# EAGLE design ComfortMaps (EAGLE 9.6.1)

## Sheet 1 of 2
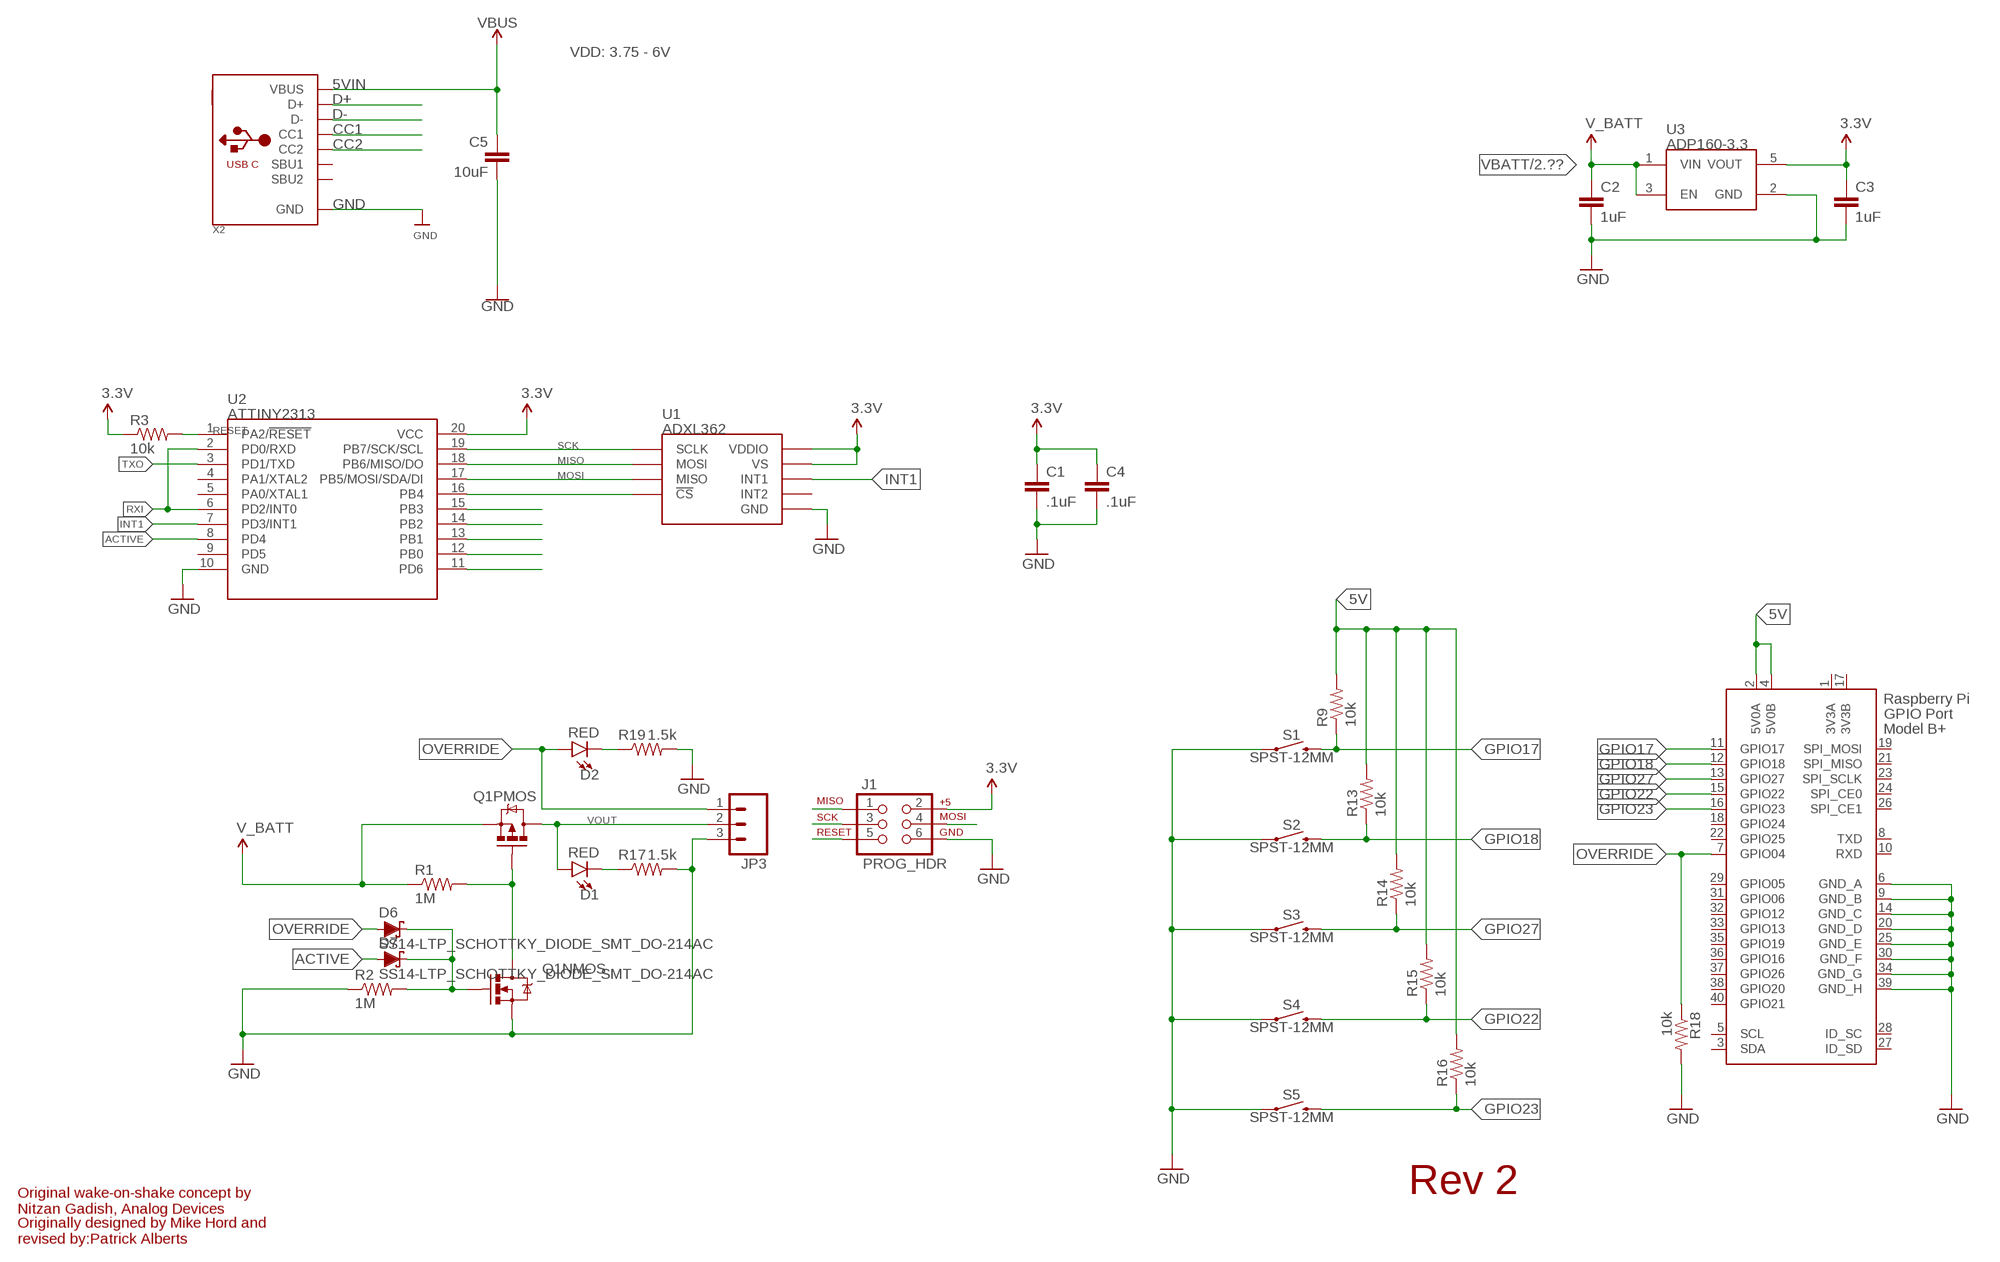
[diagram p0: schematic, sheet 1]

### Parts
C1  .1uF  0.1UF-25V(+80/-20%)(0603)  [0603-CAP]
C2  1uF  1.0UF-16V-10%(0603)  [0603-CAP]
C3  1uF  1.0UF-16V-10%(0603)  [0603-CAP]
C4  .1uF  0.1UF-25V(+80/-20%)(0603)  [0603-CAP]
C5  10uF  10UF-0603-6.3V-20%  [0603]
D1  RED  LED-RED0603  [LED-0603]
D2  RED  LED-RED0603  [LED-0603]
D6  SS14-LTP_SCHOTTKY_DIODE_SMT_DO-214AC  [DO-214AC]
D7  SS14-LTP_SCHOTTKY_DIODE_SMT_DO-214AC  [DO-214AC]
J1  PROG_HDR  AVR_SPI_PRG_6PTH  [2X3]
JP3  M03PTH  [1X03]
Q1  IRF7509  [MSOP8]
R1  1M  1MOHM1/10W1%(0603)  [0603-RES]
R2  1M  1MOHM1/10W1%(0603)  [0603-RES]
R3  10k  10K-1%RES-00824  [0603-RES]
R9  10k  10K-1%RES-00824  [0603-RES]
R13  10k  10K-1%RES-00824  [0603-RES]
R14  10k  10K-1%RES-00824  [0603-RES]
R15  10k  10K-1%RES-00824  [0603-RES]
R16  10k  10K-1%RES-00824  [0603-RES]
R17  1.5k  1.5KOHM-0603-1/10W-1%  [0603]
R18  10k  10K-1%RES-00824  [0603-RES]
R19  1.5k  1.5KOHM-0603-1/10W-1%  [0603]
S1  SPST-12MM  MOMENTARY-SWITCH-SPST-SMD-12MM  [TACTILE_SWITCH_SMD_12MM]
S2  SPST-12MM  MOMENTARY-SWITCH-SPST-SMD-12MM  [TACTILE_SWITCH_SMD_12MM]
S3  SPST-12MM  MOMENTARY-SWITCH-SPST-SMD-12MM  [TACTILE_SWITCH_SMD_12MM]
S4  SPST-12MM  MOMENTARY-SWITCH-SPST-SMD-12MM  [TACTILE_SWITCH_SMD_12MM]
S5  SPST-12MM  MOMENTARY-SWITCH-SPST-SMD-12MM  [TACTILE_SWITCH_SMD_12MM]
U1  ADXL362  ADXL362ADXL362-1:1  [ADXL362-1:1]
U2  ATTINY2313  ATTINY2313A  [SOP20W]
U3  ADP160-3.3  ADP160  [SOT23-5]
X1  RASPI_GPIO_B+#_PIN  [RASPI_GPIO_B+_PIN]
X2  USB_C  [USB_C_CUSB31-CFM2AX-01-X]

### Nets
3.3V: C1.1 C3.1 C4.1 J1.2 R3.1 U1.P$1(VDDIO) U1.P$14(VS) U2.20(VCC) U3.5(VOUT)
5V: R9.2 R13.2 R14.2 R15.2 R16.2 X1.2(5V0A) X1.4(5V0B) ; also sheet 2
5VIN: C5.1 X2.A4B9(VBUS) X2.B4A9(VBUS) ; supply symbol labelled VBUS ; also sheet 2
ACTIVE: D7.A U2.8(PD4)
CC1: X2.A5(CC1)
CC2: X2.B5(CC2)
D+: X2.A6(D+) X2.B6(D+)
D-: X2.A7(D-) X2.B7(D-)
GND: C1.2 C2.2 C3.2 C4.2 C5.2 J1.6 JP3.3 Q1.1(NMOS:S) R2.1 R17.2 R18.2 R19.2 S1.1 S1.2 S2.1 S2.2 S3.1 S3.2 S4.1 S4.2 S5.1 S5.2 U1.P$12(GND) U1.P$13(GND) U1.P$16(GND) U2.10(GND) U3.2(GND) X1.6(GND_A) X1.9(GND_B) X1.14(GND_C) X1.20(GND_D) X1.25(GND_E) X1.30(GND_F) X1.34(GND_G) X1.39(GND_H) X2.A1B12(GND) X2.B1A12(GND) ; also sheet 2
GPIO17: R9.1 S1.3 S1.4 X1.11(GPIO17)
GPIO18: R13.1 S2.3 S2.4 X1.12(GPIO18)
GPIO22: R15.1 S4.3 S4.4 X1.15(GPIO22)
GPIO23: R16.1 S5.3 S5.4 X1.16(GPIO23)
GPIO27: R14.1 S3.3 S3.4 X1.13(GPIO27)
INT1: U1.P$11(INT1) U2.7(PD3/INT1)
MISO: J1.1 U1.P$6(MOSI) U2.18(PB6/MISO/DO)
MOSI: J1.4 U1.P$7(MISO) U2.17(PB5/MOSI/SDA/DI)
N$1: Q1.4(PMOS:G) Q1.7(NMOS:D) Q1.8(NMOS:D) R1.2
N$2: D6.C D7.C Q1.2(NMOS:G) R2.2
N$3: U2.15(PB3)
N$4: U2.14(PB2)
N$5: U2.13(PB1)
N$6: U2.12(PB0)
N$7: U1.P$8(!CS) U2.16(PB4)
N$8: U2.11(PD6)
N$14: D1.C R17.1
N$16: D2.C R19.1
OVERRIDE: D2.A D6.A JP3.1 R18.1 X1.7(GPIO04)
RESET: J1.5 R3.2 U2.1(PA2/!RESET)
RXI: U2.2(PD0/RXD) U2.6(PD2/INT0)
SCK: J1.3 U1.P$4(SCLK) U2.19(PB7/SCK/SCL)
TXO: U2.3(PD1/TXD)
VBATT: C2.1 Q1.3(PMOS:S) R1.1 U3.1(VIN) U3.3(EN) ; supply symbol labelled V_BATT ; also sheet 2
VOUT: D1.A JP3.2 Q1.5(PMOS:D) Q1.6(PMOS:D)
Unconnected: U1.P$9(INT2) U2.4(PA1/XTAL2) U2.5(PA0/XTAL1) U2.9(PD5) X1.3(SDA) X1.5(SCL) X1.8(TXD) X1.10(RXD) X1.18(GPIO24) X1.19(SPI_MOSI) X1.21(SPI_MISO) X1.22(GPIO25) X1.23(SPI_SCLK) X1.24(SPI_CE0) X1.26(SPI_CE1) X1.27(ID_SD) X1.28(ID_SC) X1.29(GPIO05) X1.31(GPIO06) X1.32(GPIO12) X1.33(GPIO13) X1.35(GPIO19) X1.36(GPIO16) X1.37(GPIO26) X1.38(GPIO20) X1.40(GPIO21) X2.A8(SBU1) X2.B8(SBU2)

### Notes on the sheet
- VDD: 3.75 - 6V
- Rev 2
- Original wake-on-shake concept by
  Nitzan Gadish, Analog Devices
- Originally designed by Mike Hord and 
  revised by:Patrick Alberts

## Sheet 2 of 2
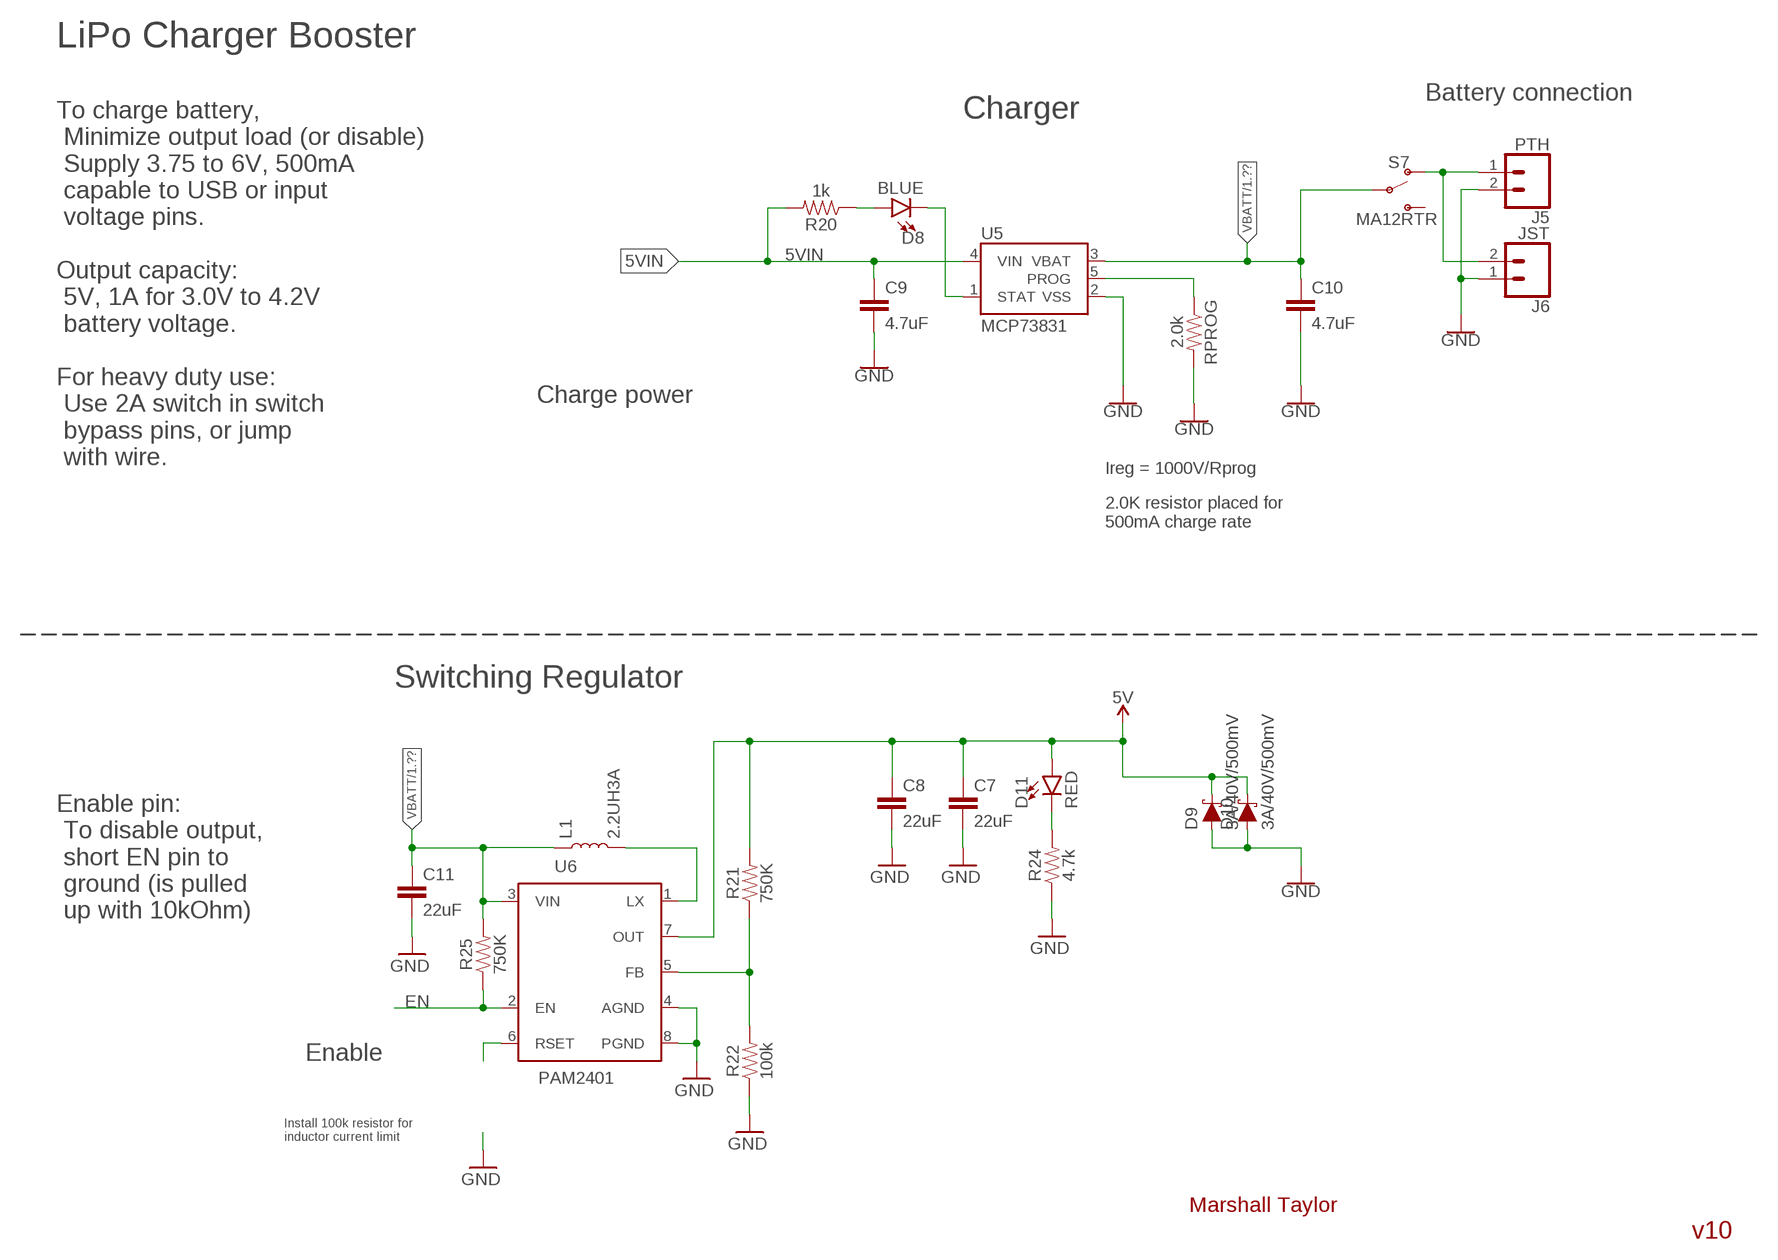
[diagram p1: schematic, sheet 2]

### Parts
C7  22uF  22UF-0805-6.3V-20%  [0805]
C8  22uF  22UF-0805-6.3V-20%  [0805]
C9  4.7uF  4.7UF0603  [0603]
C10  4.7uF  4.7UF0603  [0603]
C11  22uF  22UF-0805-6.3V-20%  [0805]
D8  BLUE  LED-BLUE0603  [LED-0603]
D9  3A/40V/500mV  DIODE-SCHOTTKY-B340A  [SMA-DIODE]
D10  3A/40V/500mV  DIODE-SCHOTTKY-B340A  [SMA-DIODE]
D11  RED  LED-RED0603  [LED-0603]
J5  PTH  CONN_02  [1X02]
J6  JST  CONN_02-JST-2MM-SMT  [JST-2-SMD]
L1  2.2UH3A  INDUCTOR-IFSC1515AHER2R2M01  [INDUCTOR_4X4MM]
R20  1k  1KOHM-0603-1/10W-1%  [0603]
R21  750K  750KOHM-0603-1/10W-1%  [0603]
R22  100k  100KOHM-0603-1/10W-1%  [0603]
R24  4.7k  4.7KOHM-0603-1/10W-1%  [0603]
R25  750K  750KOHM-0603-1/10W-1%  [0603]
RPROG  2.0k  2.0KOHM-0603-1/10W-5%  [0603]
S7  MA12RTR  SWITCH-SPDT-SMD-RIGHT-ANGLE  [SWITCH_SPST_SMD_A]
U5  MCP73831  [SOT23-5]
U6  PAM2401  [MSOP8]

### Nets
5V: C7.1 C8.1 D9.C D10.C D11.A R21.2 U6.7(OUT) ; also sheet 1
5VIN: C9.1 R20.2 U5.4(VIN) ; also sheet 1
EN: R25.1 U6.2(EN)
GND: C7.2 C8.2 C9.2 C10.2 C11.2 D9.A D10.A J5.2 J6.1 R22.1 R24.1 RPROG.2 U5.2(VSS) U6.4(AGND) U6.8(PGND) ; also sheet 1
N$9: J5.1 J6.2 S7.1(O)
N$10: RPROG.1 U5.5(PROG)
N$13: D8.C U5.1(STAT)
N$17: R21.1 R22.2 U6.5(FB)
N$18: L1.P$2 U6.1(LX)
N$19: U6.6(RSET)
N$21: D11.C R24.2
N$22: D8.A R20.1
VBATT: C10.1 C11.1 L1.P$1 R25.2 S7.2(P) U5.3(VBAT) U6.3(VIN) ; also sheet 1
Unconnected: S7.3(S)

### Notes on the sheet
- LiPo Charger Booster
- To charge battery,
   Minimize output load (or disable)
   Supply 3.75 to 6V, 500mA
   capable to USB or input
   voltage pins.
- Battery connection
- Charger
- Output capacity:
   5V, 1A for 3.0V to 4.2V
   battery voltage.
- For heavy duty use:
   Use 2A switch in switch
   bypass pins, or jump
   with wire.
- Charge power
- Ireg = 1000V/Rprog
- 2.0K resistor placed for
  500mA charge rate
- Switching Regulator
- Enable pin:
   To disable output,
   short EN pin to
   ground (is pulled
   up with 10kOhm)
- Enable
- Install 100k resistor for
  inductor current limit
- Marshall Taylor
- v10

## Power pins joined to a net without a drawn wire
3V3A: X1.1(3V3A)
3V3B: X1.17(3V3B)

## Library data of the parts
C1 C4 = SparkFun-Capacitors:0.1UF-25V(+80/-20%)(0603): CAP-00810 Ceramic Standard decoupling cap; PROD_ID: CAP-00810; VALUE: 0.1uF
C2 C3 = SparkFun-Capacitors:1.0UF-16V-10%(0603): CAP-00868; PROD_ID: CAP-00868; VALUE: 1.0uF
C5 = SparkFun-Capacitors:10UF: 10.0µF ceramic capacitors A capacitor is a passive two-terminal electrical component used to store electrical energy temporarily in an electric field.; PROD_ID: CAP-11015
C7 C8 C11 = SparkFun-Capacitors:22UF: 22µF ceramic capacitors A capacitor is a passive two-terminal electrical component used to store electrical energy temporarily in an electric field.; PROD_ID: CAP-08402
C9 C10 = SparkFun-Capacitors:4.7UF: 4.7µF ceramic capacitors A capacitor is a passive two-terminal electrical component used to store electrical energy temporarily in an electric field.; PROD_ID: CAP-08280
D1 D2 D11 = SparkFun-LED:LED-RED: Red SMD LED Used in manufacturing of most products at SparkFun Packages: 0603 - SMD 0603 package [Product Link] <http://docs.avagotech.com/docs/AV02-0551EN> 0603 SMART - SMD 0603 SMART package ( more efficient and expensive)[Product Link] <http://www.osram-os.com/Graphics/XPic2/00077099_0.pdf> 1206 - SMD1206 package [Product Link] <https://www.sparkfun.com/datasheets/DevTools/LilyPad/Q150OVS4.pdff> SparkFun Products: Pro Mini 328 -5V <https://www.sparkfun.com/products/821> RedBoard <https://www.sparkfun.com/products/12757> IOIO-OTG <https://www.sparkfun.com/products/13613>; PROD_ID: DIO-00819
D6 D7 = DIODE SCHOTTKY 1A 40V SMA:SS14-LTP_SCHOTTKY_DIODE_SMT_DO-214AC: DIODE SCHOTTKY 1A 40V SMA; DIGIKEY: SS14-LTPMSCT-ND; MF: Micro Commercial Co; MPN: SS14-LTP
D8 = SparkFun-LED:LED-BLUE: Blue SMD LED Used in manufacturing of various products at SparkFun Packages: 0603 - SMD 0603 package [Product Link] <http://www.digikey.com/product-detail/en/SMLE12BC7TT86/511-1589-2-ND/1641808> 1206 - SMD1206 package [Product Link] <http://www.digikey.com/product-detail/en/lite-on-inc/LTST-C150TBKT/160-1643-1-ND/573584> SparkFun Products: ESP8266 Thing-Dev Board <https://www.sparkfun.com/products/13711> RedBoard <https://www.sparkfun.com/products/12757>; PROD_ID: DIO-08575
D9 D10 = SparkFun-DiscreteSemi:DIODE-SCHOTTKY: Schottky diode A Schottky diode is a semiconductor diode which has a low forward voltage drop and a very fast switching action.; PROD_ID: DIO-09886
J1 = SparkFun-Connectors:AVR_SPI_PRG_6: AVR ISP 6 Pin This is the reduced ISP connector for AVR programming. Common on Arduino. This footprint will take up less PCB space and can be used with a 10-pin to 6-pin adapter such as SKU: BOB-08508
J5 = SparkFun-Connectors:CONN_02: Multi connection point. Often used as Generic Header-pin footprint for 0.1 inch spaced/style header connections On any of the 0.1 inch spaced packages, you can populate with these: Break Away Headers - Straight <https://www.sparkfun.com/products/116> (PRT-00116) Break Away Male Headers - Right Angle <https://www.sparkfun.com/products/553> (PRT-00553) Female Headers <https://www.sparkfun.com/products/115> (PRT-00115) Break Away Headers - Machine Pin <https://www.sparkfun.com/products/117> (PRT-00117) Break Away Female Headers - Swiss Machine Pin <https://www.sparkfun.com/products/743> (PRT-00743) For SCREWTERMINALS and SPRING TERMINALS visit here: Screw Terimnals on SparkFun.com <https://www.sparkfun.com/search/results?term=Screw+Terminals> (5mm/3.5mm/2.54mm spacing) This device is also useful as a general connection point to wire up your design to another part of your project. Our various solder wires solder well into these plated through hole pads. Hook-Up Wire - Assortment (Stranded, 22 AWG) <https://www.sparkfun.com/products/11375> (PRT-11375) Hook-Up Wire - Assortment (Solid Core, 22 AWG) <https://www.sparkfun.com/products/11367> (PRT-11367) View the entire wire category on our website here <https://www.sparkfun.com/categories/141> Special notes: Molex polarized connector foot print use with: PRT-08233 with associated crimp pins and housings. 2.54_SCREWTERM for use with PRT-10571. 3.5mm Screw Terminal footprints for PRT-08084 5mm Screw Terminal footprints for use with PRT-08432
J6 = SparkFun-Connectors:CONN_02: Multi connection point. Often used as Generic Header-pin footprint for 0.1 inch spaced/style header connections On any of the 0.1 inch spaced packages, you can populate with these: Break Away Headers - Straight <https://www.sparkfun.com/products/116> (PRT-00116) Break Away Male Headers - Right Angle <https://www.sparkfun.com/products/553> (PRT-00553) Female Headers <https://www.sparkfun.com/products/115> (PRT-00115) Break Away Headers - Machine Pin <https://www.sparkfun.com/products/117> (PRT-00117) Break Away Female Headers - Swiss Machine Pin <https://www.sparkfun.com/products/743> (PRT-00743) For SCREWTERMINALS and SPRING TERMINALS visit here: Screw Terimnals on SparkFun.com <https://www.sparkfun.com/search/results?term=Screw+Terminals> (5mm/3.5mm/2.54mm spacing) This device is also useful as a general connection point to wire up your design to another part of your project. Our various solder wires solder well into these plated through hole pads. Hook-Up Wire - Assortment (Stranded, 22 AWG) <https://www.sparkfun.com/products/11375> (PRT-11375) Hook-Up Wire - Assortment (Solid Core, 22 AWG) <https://www.sparkfun.com/products/11367> (PRT-11367) View the entire wire category on our website here <https://www.sparkfun.com/categories/141> Special notes: Molex polarized connector foot print use with: PRT-08233 with associated crimp pins and housings. 2.54_SCREWTERM for use with PRT-10571. 3.5mm Screw Terminal footprints for PRT-08084 5mm Screw Terminal footprints for use with PRT-08432; PROD_ID: CONN-11443
JP3 = SparkFun-Connectors:M03: Header 3 Standard 3-pin 0.1" header. Use with straight break away headers (SKU : PRT-00116), right angle break away headers (PRT-00553), swiss pins (PRT-00743), machine pins (PRT-00117), and female headers (PRT-00115). Molex polarized connector foot print use with SKU : PRT-08232 with associated crimp pins and housings.
L1 = SparkFun-Coils:INDUCTOR: Inductors Resist changes in electrical current. Basically a coil of wire. SparkFun Products: SparkFun Load Cell Amplifier - HX711 <https://www.sparkfun.com/products/13879> IOIO-OTG - V2.2 <https://www.sparkfun.com/products/13613>; PROD_ID: NDUC-13770
Q1 = SparkFun-DiscreteSemi:IRF7509: 30V Dual PMOS/NMOS MSOP-8 NMOS RDS .11-ohm PMOS RDS .20-ohm; PROD_ID: TRANS-07913
R1 R2 = SparkFun-Resistors:1MOHM1/10W1%(0603): RES-07868; PROD_ID: RES-07868
R3 R9 R13-R16 R18 = SparkFun-Resistors:10K-1%: 10k-ohm SMT 1/10W - 1% (0603) RES-00824; PROD_ID: RES-00824
R17 R19 = SparkFun-Resistors:1.5KOHM: 1.5kΩ resistor A resistor is a passive two-terminal electrical component that implements electrical resistance as a circuit element. Resistors act to reduce current flow, and, at the same time, act to lower voltage levels within circuits. - Wikipedia; PROD_ID: RES-08306
R20 = SparkFun-Resistors:1KOHM: 1kΩ resistor A resistor is a passive two-terminal electrical component that implements electrical resistance as a circuit element. Resistors act to reduce current flow, and, at the same time, act to lower voltage levels within circuits. - Wikipedia; PROD_ID: RES-07856
R21 R25 = SparkFun-Resistors:750KOHM: 750Ω resistor A resistor is a passive two-terminal electrical component that implements electrical resistance as a circuit element. Resistors act to reduce current flow, and, at the same time, act to lower voltage levels within circuits. - Wikipedia; PROD_ID: RES-13768
R22 = SparkFun-Resistors:100KOHM: 100kΩ resistor A resistor is a passive two-terminal electrical component that implements electrical resistance as a circuit element. Resistors act to reduce current flow, and, at the same time, act to lower voltage levels within circuits. - Wikipedia; PROD_ID: RES-07828
R24 = SparkFun-Resistors:4.7KOHM: 4.7kΩ resistor A resistor is a passive two-terminal electrical component that implements electrical resistance as a circuit element. Resistors act to reduce current flow, and, at the same time, act to lower voltage levels within circuits. - Wikipedia; PROD_ID: RES-07857
RPROG = SparkFun-Resistors:2.0KOHM: 2kΩ resistor A resistor is a passive two-terminal electrical component that implements electrical resistance as a circuit element. Resistors act to reduce current flow, and, at the same time, act to lower voltage levels within circuits. - Wikipedia; PROD_ID: RES-08296
S1-S5 = CM-SparkFun-Switches:MOMENTARY-SWITCH-SPST: Momentary Switch (Pushbutton) - SPST Normally-open (NO) SPST momentary switches (buttons, pushbuttons). Variants PTH-12MM - 12mm square, through-hole Momentary Pushbutton Switch - 12mm Square <https://www.sparkfun.com/products/9190> (COM-09190) PTH-6.0MM, PTH-6.0MM-KIT - 6.0mm square, through-hole Mini Pushbutton Switch <https://www.sparkfun.com/products/97> (COM-00097) KIT package intended for soldering kit's - only one side of pads' copper is exposed. PTH-RIGHT-ANGLE-KIT - Right-angle, through-hole Right Angle Tactile Button <https://www.sparkfun.com/products/10791> - Used on SparkFun BigTime Watch Kit <https://www.sparkfun.com/products/11734> SMD-12MM - 12mm square, surface-mount Tactile Button - SMD (12mm) <https://www.sparkfun.com/products/12993> (COM-12993) Used on SparkFun PicoBoard <https://www.sparkfun.com/products/11888> SMD-4.5MM - 4.5mm Square Trackball Switch Used on SparkFun Blackberry Trackballer Breakout <https://www.sparkfun.com/products/13169> SMD-4.6MMX2.8MM - 4.60mm x 2.80mm, surface mount Used on SparkFun SAMD21 Mini Breakout <https://www.sparkfun.com/products/13664> SMD-5.2MM, SMD-5.2-REDUNDANT - 5.2mm square, surface-mount Mini Pushbutton Switch - SMD <https://www.sparkfun.com/products/8720> (COM-08720) Used on Arduino Pro Mini <https://www.sparkfun.com/products/11114> REDUNDANT package connects both switch circuits together SMD-6.0X3.5MM - 6.0 x 3.5mm, surface mount Momentary Reset Switch SMD <https://www.sparkfun.com/products/8229> (COM-08229) SMD-6.2MM-TALL - 6.2mm square, surface mount Tactile Button - SMD (6mm) <https://www.sparkfun.com/products/12992> Used on SparkFun Digital Sandbox <https://www.sparkfun.com/products/12651> SMD-RIGHT-ANGLE - Right-angle, surface mount Used on SparkFun Block for Intel® Edison - Arduino <https://www.sparkfun.com/products/13036>; PROD_ID: SWCH-11967; SF_SKU: COM-12993
S7 = SparkFun-Switches:SWITCH-SPDT: Single Pole, Double Throw (SPDT) Switch Single-pole, double-throw (SPDT) switch. Variant Overview SMD-AYZ0202 Surface Mount DPDT Switch <https://www.sparkfun.com/products/597> (COM-00597) Used on e.g. LilyPad Arduino USB - ATmega32U4 Board <https://www.sparkfun.com/products/12049> PTH-11.6X4.0MM SPDT Mini Power Switch <https://www.sparkfun.com/products/102> (COM-00102) Used on e.g. SparkFun Simon Says - Through-Hole Soldering Kit <https://www.sparkfun.com/products/10547> (KIT-10547) PTH-11.6X4.0MM-KIT KIT version of SPDT Mini Power Switch - Simplifies soldering by removing tStop of switch pins - only one side can be soldered. PTH-11.6X4.0MM-LOCK LOCK version of SPDT Mini Power Switch - Offset pins hold switch in place for easier soldering. SMD-RIGHT-ANGLE Surface Mount Right Angle Switch <https://www.sparkfun.com/products/10860> (COM-10860) Used on e.g. SparkFun ESP8266 Thing <https://www.sparkfun.com/products/13231>; DIGIKEY: 679-1847-1-ND; PROD_ID: SWCH-10651; SF_SKU: COM-10860
U1 = SparkFun-Sensors:ADXL362: Micropower 3-axis accelerometer 2/4/8g digital output (SPI) IC-11297
U2 = SparkFun-DigitalIC:ATTINY2313A: ATTINY2313A 2kB 20MHz I2C/SPI/UART; DIST: DIGIKEY; DIST_ID: ATTINY2313A-SU-ND; PROD_ID: IC-11305; VALUE: ATTINY2313A
U3 = SparkFun-PowerIC:ADP160: Nanopower LDO Iq less than 1uA for low Iload; DIST: Digikey; DIST_ID: ADP160AUJZ-3.3-R7TR-ND; PROD_ID: VREG-11306; VALUE: ADP160
U5 = SparkFun-IC-Power:MCP73831: MCP73831T Li-Ion, Li-Pol Controller Miniature single cell, fully integrated Li-Ion, Li-polymer charge management controller Datasheet <http://ww1.microchip.com/downloads/en/DeviceDoc/20001984g.pdf> SparkFun Products: SparkFun ESP32 Thing <https://www.sparkfun.com/products/13907> SparkFun 9DoF Razor IMU M0 <https://www.sparkfun.com/products/14001>; PROD_ID: IC-09995
U6 = SparkFun-IC-Power:PAM2401: PAM2401 - Boost PMIC Specifications: Up to 1A output current 0.9V to 4.75V Input Range 2.5V to 5.0V Adjustable Output Voltage Datasheet <https://www.diodes.com/assets/Datasheets/PAM2401.pdf> (Diodes inc.); PROD_ID: IC-13769
X1 = raspberrypi_bastelstube_v13:RASPI_GPIO_B+#: 2x20 header connector, all pins connected
X2 = microbuilder:USB_C: USB Type-C USB 2.0 Connector

## Net classes
0 default: width 0.152 mm, drill 0.305 mm, clearance 0.152 mm

## Board
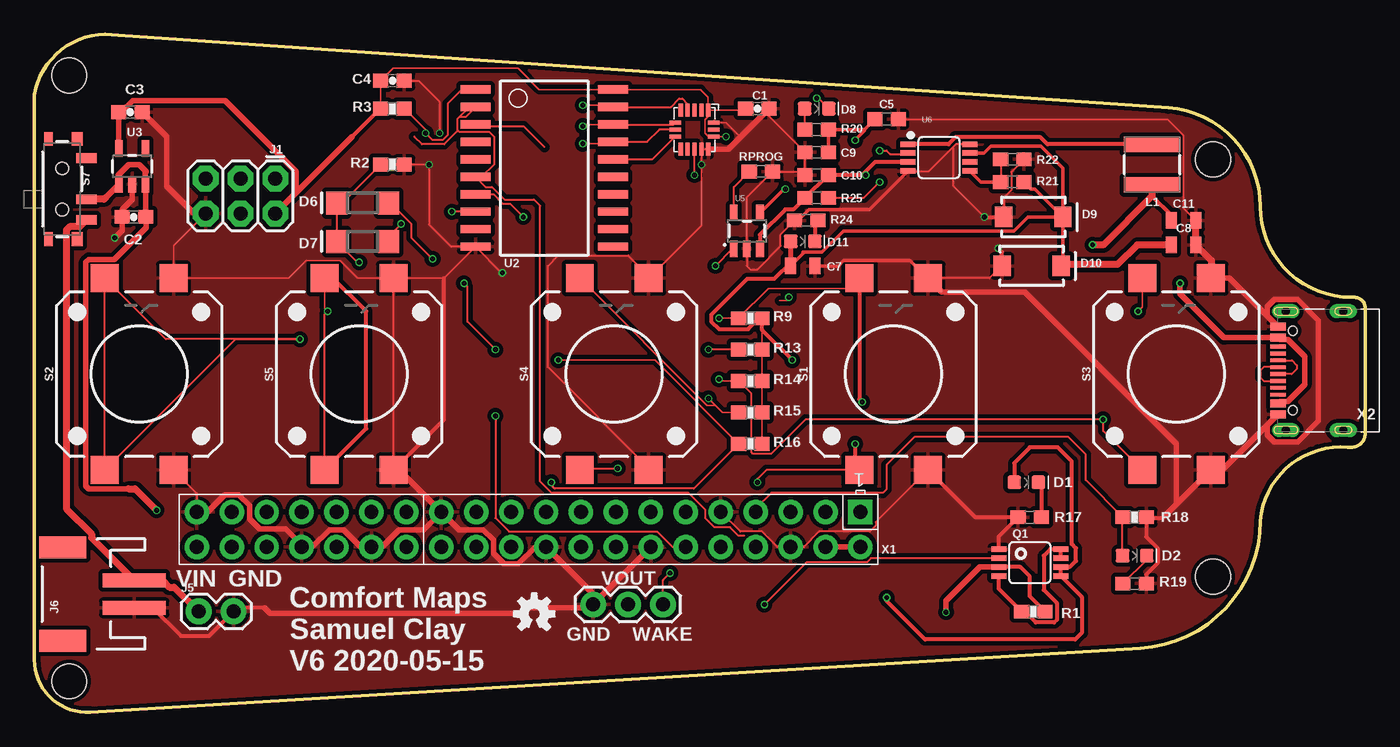
[diagram p2: board, top side]
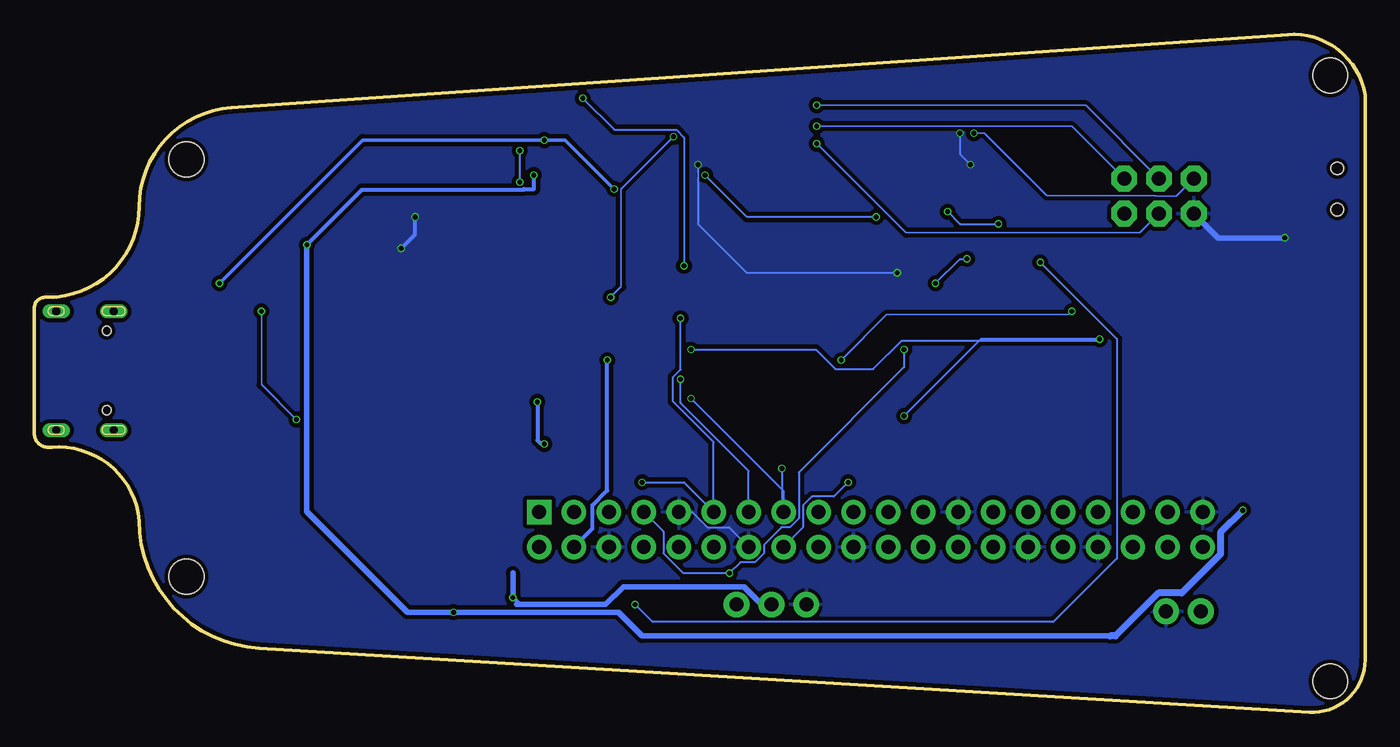
[diagram p3: board, bottom side, seen from below]

Size 96.77 x 49.31 mm. Coordinates in mm from the lower left corner, seen from the top.
Outline: 96.77,20.28 96.77,29.42 arc90 96.01,30.19 95.76,30.19 arc-90 89.15,36.79 arc86 82.45,43.97 6.11,49.24 arc90 0,44.9 0,3.82 arc93 4.06,0 80.44,4.65 arc86 89.15,13.93 arc-90 95.5,19.26 95.76,19.26 arc90 96.77,20.28
Copper layers (1*16): Top 0.035mm / dielectric 0.213359375mm / Bottom 0.035mm
Design rules "SparkFun-4-layer-PCBWAY-LIMIT *": minimum track width 5mil, minimum drill 0.3mm, track to track 6mil, track to pad 6mil, pad to pad 5mil, via to via 6mil, smd to smd 0mil, copper to edge 5mil, drill to drill 5mil, minimum pad ring 3mil, minimum via ring 3mil, stop-mask expansion 4mil, vias tented up to drill 25mil, thermal gap 10mil
Holes 2.54 mm at 2.54,46.31 2.54,2.25 85.72,9.87 85.72,40.22

### Footprints (pad centres in the part's own frame; a part is rotated, then mirrored left to right if it is on the bottom)
0603-CAP = smd 1.1 x 1: 1 -0.85,0; 2 0.85,0
0603 = smd 1.1 x 1: 1 -0.85,0; 2 0.85,0
0805 = smd 0.8 x 1.2: 1 -0.9,0; 2 0.9,0
LED-0603 = smd 1 x 1: A -0.877,0; C 0.877,0
DO-214AC = smd 1.524 x 1.676: A 1.88,0; C -1.88,0
SMA-DIODE = smd 1.27 x 1.47: A -2.15,0; C 2.15,0
2X3 = drill 1.016 pad 1.88 octagon: 1 0,0; 2 0,2.54; 3 2.54,0; 4 2.54,2.54; 5 5.08,0; 6 5.08,2.54
1X02 = drill 1.016 pad 1.88: 1 0,0; 2 2.54,0
JST-2-SMD = smd 1 x 4.6: 1 -1,-3.7; 2 1,-3.7 | smd 1.6 x 3.4: NC1 -3.4,1.5; NC2 3.4,1.5
1X03 = drill 1.016 pad 1.88: 1 0,0; 2 2.54,0; 3 5.08,0
INDUCTOR_4X4MM = smd 4.089 x 1.143: P$1 0,1.473; P$2 0,-1.473
MSOP8 = smd 0.4 x 1.1: 1 -0.975,-2.25; 2 -0.325,-2.25; 3 0.325,-2.25; 4 0.975,-2.25; 5 0.975,2.25; 6 0.325,2.25; 7 -0.325,2.25; 8 -0.975,2.25
0603-RES = smd 1.1 x 1: 1 -0.85,0; 2 0.85,0
TACTILE_SWITCH_SMD_12MM = smd 2.032 x 2.032: 1 6.975,-2.5; 2 -6.975,-2.5; 3 6.975,2.5; 4 -6.975,2.5
SWITCH_SPST_SMD_A = smd 0.7 x 1.5: 1 -2.25,-1.75; 2 -0.75,-1.75; 3 2.25,-1.75 | smd 1 x 0.6: GND1 -3.65,1; GND3 3.65,1 | smd 1 x 0.8: GND2 -3.65,-1.1; GND4 3.65,-1.1 | hole 0.9: -1.5,0; 1.5,0
ADXL362-1:1 = smd 0.952 x 0.3: P$1 -1.426,1; P$2 -1.426,0.5; P$3 -1.426,0; P$4 -1.426,-0.5; P$5 -1.426,-1; P$9 1.426,-1; P$10 1.426,-0.5; P$11 1.426,0; P$12 1.426,0.5; P$13 1.426,1 | smd 0.3 x 0.851: P$6 -0.5,-1.402; P$7 0,-1.402; P$8 0.5,-1.402; P$14 0.5,1.402; P$15 0,1.402; P$16 -0.5,1.402
SOP20W = smd 0.6 x 2.2: 1 -5.715,-5; 2 -4.445,-5; 3 -3.175,-5; 4 -1.905,-5; 5 -0.635,-5; 6 0.635,-5; 7 1.905,-5; 8 3.175,-5; 9 4.445,-5; 10 5.715,-5; 11 5.715,5; 12 4.445,5; 13 3.175,5; 14 1.905,5; 15 0.635,5; 16 -0.635,5; 17 -1.905,5; 18 -3.175,5; 19 -4.445,5; 20 -5.715,5
SOT23-5 = smd 0.55 x 1.2: 1 -0.95,-1.3; 2 0,-1.3; 3 0.95,-1.3; 4 0.95,1.3; 5 -0.95,1.3
RASPI_GPIO_B+_PIN = drill 1 pad 1.778 square: 1 -24.13,-1.27 | drill 1 pad 1.778: 2 -24.13,1.27; 3 -21.59,-1.27; 4 -21.59,1.27; 5 -19.05,-1.27; 6 -19.05,1.27; 7 -16.51,-1.27; 8 -16.51,1.27; 9 -13.97,-1.27; 10 -13.97,1.27; 11 -11.43,-1.27; 12 -11.43,1.27; 13 -8.89,-1.27; 14 -8.89,1.27; 15 -6.35,-1.27; 16 -6.35,1.27; 17 -3.81,-1.27; 18 -3.81,1.27; 19 -1.27,-1.27; 20 -1.27,1.27; 21 1.27,-1.27; 22 1.27,1.27; 23 3.81,-1.27; 24 3.81,1.27; 25 6.35,-1.27; 26 6.35,1.27; 27 8.89,-1.27; 28 8.89,1.27; 29 11.43,-1.27; 30 11.43,1.27; 31 13.97,-1.27; 32 13.97,1.27; 33 16.51,-1.27; 34 16.51,1.27; 35 19.05,-1.27; 36 19.05,1.27; 37 21.59,-1.27; 38 21.59,1.27; 39 24.13,-1.27; 40 24.13,1.27
USB_C_CUSB31-CFM2AX-01-X = smd 0.575 x 1.15: A1B12 -3.2,7.355; A4B9 -2.4,7.355; B1A12 3.2,7.355; B4A9 2.4,7.355 | smd 0.275 x 1.15: A5 -1.25,7.355; A6 -0.25,7.355; A7 0.25,7.355; A8 1.25,7.355; B5 1.75,7.355; B6 0.75,7.355; B7 -0.75,7.355; B8 -1.75,7.355 | drill 0.6 pad 1 long: M1 -4.32,6.78; M2 4.32,6.78; M3 -4.32,2.6; M4 4.32,2.6 | hole 0.65: 2.89,6.28; -2.89,6.28

### Placement (x,y rotation side)
C1  52.58,43.9 0 top
C2  7.24,36.03 180 top
C3  6.98,43.65 0 top
C4  26.04,45.93 0 top
C5  61.98,43.14 0 top
C7  55.88,32.47 0 top
C8  83.57,34 0 top
C9  56.9,40.73 180 top
C10  56.9,39.08 180 top
C11  83.57,35.77 0 top
D1  72.14,16.72 0 top
D2  80.01,11.39 0 top
D6  23.88,37.04 0 top
D7  23.88,34.25 0 top
D8  56.9,43.9 0 top
D9  72.64,36.03 0 top
D10  72.52,32.47 0 top
D11  55.88,34.25 0 top
J1  17.53,38.82 180 top
J5  11.94,7.33 0 top
J6  3.56,8.6 90 top
JP3  45.72,7.83 180 top
L1  81.28,39.84 180 top
Q1  72.39,10.88 270 top
R1  72.64,7.33 180 top
R2  26.04,39.84 180 top
R3  26.04,43.9 0 top
R9  52.07,28.66 0 top
R13  52.07,26.38 0 top
R14  52.07,24.09 0 top
R15  52.07,21.8 0 top
R16  52.07,19.52 0 top
R17  72.39,14.18 180 top
R18  80.01,14.18 0 top
R19  80.01,9.36 0 top
R20  56.9,42.38 0 top
R21  71.12,38.57 0 top
R22  71.12,40.22 180 top
R24  56.13,35.77 0 top
R25  56.9,37.42 180 top
RPROG  52.83,39.33 0 top
S1  62.48,24.6 90 top
S2  7.62,24.6 90 top
S3  83.06,24.6 90 top
S4  42.16,24.6 90 top
S5  23.62,24.6 90 top
S7  2.03,38.06 90 top
U1  48.01,42.38 270 top
U2  37.08,39.58 270 top
U3  7.11,39.71 0 top
U5  51.82,35.01 0 top
U6  65.79,40.35 270 top
U$3  [OSHW-LOGO-S]  36.35,7.15 0 top
X1  35.94,13.29 180 top
X2  97.79,24.85 90 top

### Tracks (layer width: path | path; a pad name or v marks a point on that pad's centre or on a via)
3.3V  (via drill 0.35)
  Top 0.127: U1.P$1 49.01,43.36 48.77,43.12 48.77,42.14 49.15,41.76 49.29,41.76 U1.P$14 v50.29,41.87 | U1.P$1 51.63,43.8 C1.1 | U1.P$1 49,43.81 49,44.75 48.45,45.3 U2.20 36.7,45.3 35.17,46.83 26.08,46.83 C4.1 R3.1 | 54.19,29.93 54.86,29.93 v54.86,30.19
  Top 0.152: 6.13,41.11 6.13,41.04 U3.5
  Top 0.305: 23.11,41.87 25.15,43.9 R3.1
  Top 0.406: 6.13,41.11 C3.1 6.28,43.65 7.14,44.5 13.88,44.5 19.05,39.33 19.05,37.81 J1.2 23.11,41.87
  Bottom 0.127: v54.86,30.19 54.1,30.95 54.1,38.06 v50.29,41.87
5V  (via drill 0.35)
  Top 0.127: R9.2 R13.2 R14.2 R15.2 R16.2
  Top 0.254: U6.7 69.05,40.67 69.56,41.18 73.2,41.18 74.79,39.58 D9.C | D9.C 72.76,38.06 72.48,38.06 R21.2 | D9.C 74.79,32.6 D10.C | C7.1 55.88,33.37 55.88,33.49 56.21,33.49 56.23,33.47 57.28,33.47 58.83,35.01 71.25,35.01 72.26,36.03 D9.C
  Top 0.305: C7.1 54.98,34.23 D11.A 55,32.73 53.79,31.51 51.84,31.51 49.22,28.9 49.22,28.43 49.79,27.86 51.9,27.86 52.7,28.66 R9.2 52.92,27.81 v55.12,25.61
  Top 0.406: X1.2 X1.4
  Top 0.508: D10.C 74.76,32.56 78.76,32.56 80.19,34 C8.1
  Bottom 0.305: X1.4 56.18,13.37 56.18,15.06 55.12,16.13 v55.12,25.61
5VIN  (via drill 0.35)
  Top 0.254: C5.1 60.36,42.38 | 60.36,42.38 R20.2 C9.1 | U5.4 54.51,38.06 v54.61,38.06 | v59.69,41.62 60.36,42.29 60.36,42.38
  Top 0.406: v83.31,31.2 83.31,30.44 86.5,27.25 X2.B4A9 90.59,27.09 91.16,27.09 92.38,25.87 92.38,23.83 91.16,22.61 90.59,22.61 X2.A4B9
  Bottom 0.254: v54.61,38.06 58.17,41.62 v59.69,41.62 72.9,41.62 v83.31,31.2
ACTIVE  (via drill 0.35)
  Top 0.152: U2.8 v30.35,36.41 | v26.67,35.52 25.76,34.61 D7.A
  Bottom 0.152: v30.35,36.41 29.46,35.52 v26.67,35.52
D+
  Top 0.152: X2.B6 91.43,25.6 91.44,25.61 91.82,25.23 91.82,24.98 91.44,24.6 X2.A6
D-
  Top 0.152: X2.A7 89.4,25.1 89.15,24.85 89.15,24.34 89.4,24.1 X2.B7
EN  (via drill 0.35)
  Top 0.152: R25.1 60.33,37.42 v61.47,38.57 | v61.47,40.85 61.98,40.85 62.23,40.6 63.47,40.6 U6.2
  Bottom 0.152: v61.47,38.57 v61.47,40.85
GND  (via drill 0.35)
  Top 0.127: U1.P$16 50.29,42.89 51.19,41.99 51.19,41.75 50.39,40.95 U1.P$13 U1.P$12 v48.51,39.84 48.51,35.41 44.75,31.66 S4.1 | S3.1 85.6,31.57 | U2.10 29.79,31.57 26.16,31.57 S5.1 23.51,31.57 22.24,32.84 19.75,32.84 18.48,31.57 S2.1 10.12,33.96 J1.6
  Top 0.152: v34.04,31.96 33.99,31.96 U2.10 30.31,33.87 28.7,35.47 v28.7,39.84 R2.1 | C4.2 27.94,45.93 29.46,44.41 v29.46,42.12 | X1.9 51.33,13.14 52.91,13.14 54.03,12.02 X1.6 55.95,12.02 57.07,13.14 60.75,13.14 61.19,13.58 61.19,13.83 S1.2 | S2.2 11.81,15.93 X1.39 | S5.2 26.12,31.53 26.16,31.57 | S4.2 44.66,17.78 37.34,25.11 37.34,32.47 38.1,33.23 43.18,33.23 44.75,31.66 | 82.21,14.27 82.12,14.18 | 85.26,17.32 S3.2 | R22.1 71.05,39.3 71.05,37.97 70.49,37.42 D9.A | U6.8 67.02,41.32 66.8,41.11 | 66.8,41.11 66.8,38.31 v69.09,36.03 | 70.43,35.96 70.37,35.9 | D10.A 69.47,31.57 S1.1 | C1.2 53.43,43.34 C9.2 C10.2 55.79,39.33 RPROG.2 51.82,37.46 U5.2 51.82,32.47 52.07,32.22 52.58,32.22 54.27,33.91 54.27,34.76 R24.1 | U6.4 65.06,39.37 66.8,41.11 | C11.2 83.55,36.69 83.55,41.98 82.39,43.14 C5.2
  Top 0.254: C7.2 58.46,32.47 58.85,32.87 63.69,32.87 S1.1 | R24.1 55.54,35.77 56.32,36.55 60.72,36.55 U6.4
  Top 0.305: S5.2 29.79,21.29 29.79,31.57 | Q1.1 70.14,12.78 R17.2 68.42,14.18 S1.2 | 70.43,35.96 D9.A v69.09,36.03 | D10.A 70.37,33.48 v70.1,33.74 | 82.21,14.27 82.04,14.1 80.94,14.1 | R18.2 80.86,12.76 81.69,11.93 81.69,10.85 80.86,10.02 R19.2 | 16.76,7.58 14.73,7.58 J5.2 12.7,5.55 10.67,5.55 8.62,7.6 J6.1
  Top 0.406: 7.11,37.98 U3.2 7.11,37.3 6.39,36.57 C2.2 6.39,35.05 v5.84,34.5 | 7.83,43.86 C3.2 9.63,41.86 9.63,38.28 11.63,36.28 J1.6 | X1.25 28.3,13.27 26.54,13.27 25.29,12.02 X1.30 23.73,12.02 22.49,13.27 21.46,13.27 20.21,12.02 19.56,12.02 | X1.34 19.56,12.02 | X1.39 12.59,14.56 13.83,15.81 14.87,15.81 15.65,15.03 15.65,14.05 16.38,13.32 18.26,13.32 19.56,12.02 | X1.25 30.89,13.27 32.65,13.27 33.38,12.54 33.38,11.56 34.16,10.78 35.19,10.78 36.43,12.02 X1.20 40.64,8.6 JP3.3 | X1.14 JP3.3 | 16.76,7.58 17.14,7.2 35.43,7.2 35.81,7.58 40.39,7.58 JP3.3 | S5.2 26.53,17.62 X1.25 | J1.6 | 90.16,28.32 90.17,28.32 X2.B1A12 90.16,28.32 | 85.6,31.57 86.9,31.57 89.65,28.82 | 85.26,17.32 86.09,17.32 89.65,20.89 | C1.2 50.48,40.95 U1.P$13 | S1.1 66,30.56 72.02,30.56 83.06,19.52 83.06,15.12 | 83.06,15.12 82.21,14.27 | 89.65,20.89 90.16,21.39 90.17,21.39 X2.A1B12 | 89.65,20.89 89.65,20.18 90.16,19.68 91.86,19.68 93.38,21.19 93.38,28.51 91.86,30.03 90.16,30.03 89.65,29.53 89.65,28.82 | 89.65,28.82 90.16,28.32 | 83.06,15.12 S3.2 | 80.94,14.1 R18.2
  Top 0.508: C11.2 C8.2 85.6,32.86 85.6,31.57
  Bottom 0.152: v34.04,31.96 44.96,31.96 48.51,35.52 v48.51,39.83 v48.51,39.84 | v29.46,42.12 29.46,40.6 v28.7,39.84 | X1.9 48.95,14.56 47.83,13.45 46.25,13.45 X1.14
  Bottom 0.305: v70.1,33.74 69.09,34.76 v69.09,36.03
  Bottom 0.406: v5.84,34.5 10.67,34.5 J1.6
  pour Bottom (isolate 0.305, rank 6): 0,49.24 101.09,49.24 101.09,-0.29 0,-0.29
  pour Top (isolate 0.305, rank 6): 0,-0.29 0,49.24 101.09,49.24 101.09,-0.29
GPIO17  (via drill 0.35)
  Top 0.127: S1.3 59.22,30.81 53.37,30.81 R9.1 v49.78,28.66
  Top 0.152: S1.4 59.94,17.62 53.22,17.62 52.58,16.98 v52.58,16.72
  Top 0.305: S1.3 59.98,22.78 v60.2,22.57 | v59.69,19.52 59.69,17.88 59.94,17.62
  Bottom 0.152: v49.78,28.66 49.78,24.92 50.32,24.38 50.32,22.6 47.37,19.66 X1.11 49.53,16.72 v52.58,16.72
  Bottom 0.305: v60.2,22.57 60.2,19.77 59.94,19.52 v59.69,19.52
GPIO18  (via drill 0.35)
  Top 0.152: X1.12 46.41,12.02 45.29,13.14 34.51,13.14 33.53,14.13 v33.53,21.55 | R13.1 v49.02,26.38 | v19.3,27.14 9.55,27.14 S2.3 S2.4 14.63,27.14 v19.3,27.14
  Bottom 0.152: v49.02,26.38 39.94,26.38 38.52,24.95 35.77,24.95 33.7,27.03 19.41,27.03 v19.3,27.14 27.94,27.14 v33.53,21.55
GPIO22  (via drill 0.35)
  Top 0.127: R15.1 50.04,21.8 49.53,22.31 | 49.53,22.31 v49.02,22.82 | S4.3 48.92,22.31 49.53,22.31
  Top 0.152: S4.4 39.78,17.74 v42.42,17.74
  Bottom 0.152: v49.02,22.82 42.29,16.09 X1.15 42.42,14.69 v42.42,17.74
GPIO23  (via drill 0.35)
  Top 0.127: R16.1 45.12,25.61 v38.1,25.61 | v21.34,29.17 21.12,29.38 S5.3
  Top 0.152: R16.1 47.97,16.27 37.85,16.27 37.59,16.52 v37.59,16.72 | S5.4 21.12,28.96 v21.34,29.17
  Top 0.305: S5.4 24.13,20.63 24.13,29.17 21.59,31.71 21.84,31.96
  Bottom 0.127: v38.1,25.61 34.8,28.92 21.59,28.92 v21.34,29.17
  Bottom 0.152: v37.59,16.72 38.63,15.68 40.21,15.68 40.87,15.03 40.87,13.45 X1.16
GPIO27  (via drill 0.35)
  Top 0.127: R14.1 49.91,24.09 v49.78,24.22 | S3.3 80.56,29.46 v80.26,29.17
  Top 0.152: R14.1 52.14,23.17 52.14,18.92 52.27,18.79 53.56,18.79 56.07,21.3 v77.72,21.3 77.72,20.46 S3.4
  Bottom 0.127: v80.26,29.17 80.26,23.84 v77.72,21.3
  Bottom 0.152: v49.78,24.22 49.78,22.5 44.83,17.55 X1.13
INT1  (via drill 0.35)
  Top 0.152: U2.7 33.38,37.68 34.06,36.99 34.59,36.99 v35.56,36.03 | v48.01,39.08 U1.P$11
  Bottom 0.152: v35.56,36.03 44.96,36.03 v48.01,39.08
MISO  (via drill 0.35)
  Top 0.127: v39.88,42.63 40,42.76 42.67,42.76
  Top 0.152: U2.18 42.67,42.76 46.48,42.76 U1.P$6
  Bottom 0.127: J1.1 21.34,42.63 v39.88,42.63
MOSI  (via drill 0.35)
  Top 0.127: v39.88,41.36 42.04,41.36 42.16,41.49
  Top 0.152: U1.P$7 45.45,42.38 44.55,41.49 42.16,41.49 U2.17
  Bottom 0.127: J1.4 16.39,34.87 33.39,34.87 v39.88,41.36
N$1
  Top 0.305: Q1.4 70.14,8.98 R1.2 72.01,7.33 72.82,6.52 74.17,6.52 74.35,6.7 74.35,7.95 73.4,8.9 73.4,11.39 73.87,11.86 Q1.8 Q1.7
N$2  (via drill 0.35)
  Top 0.127: R2.2 22.64,37.3 22.64,37.04 22.64,36.81
  Top 0.152: 70.07,11.14 Q1.2 60.83,11.21 60.53,10.91 56.16,10.91 v53.09,7.83 | v23.62,32.73 23.52,32.73 D7.C D6.C 22.64,37.04
  Bottom 0.152: v23.62,32.73 18.05,27.15 18.05,11.19 22.68,6.56 51.82,6.56 v53.09,7.83
N$7
  Top 0.152: U2.16 44.95,40.22 U1.P$8
N$9
  Top 0.508: S7.1 3.29,35.32 2.56,35.32 2.33,35.08 2.33,14.8 4.16,12.96 4.16,12.69 J6.2 9.31,9.6 9.81,9.1 10.17,9.1 J5.1
N$10
  Top 0.152: U5.5 50.87,38.21 RPROG.1
N$13  (via drill 0.35)
  Top 0.152: D8.C 57.01,44.66 v56.9,44.66 | v49.53,32.47 50.77,33.71 U5.1
  Bottom 0.152: v56.9,44.66 54.59,42.36 50.09,42.36 49.53,41.8 v49.53,32.47
N$14
  Top 0.305: D1.C 73.24,16.5 R17.1
N$16
  Top 0.152: D2.C 80.89,11.08 R19.1
N$17
  Top 0.152: R22.2 R21.1
  Top 0.254: R21.1 68.84,38.57 U6.5
N$18
  Top 0.305: L1.P$2 73.68,41.31 73.16,41.83 66.98,41.83 66.48,41.32 U6.1
N$21
  Top 0.305: R24.2 56.76,35.55 D11.C
N$22
  Top 0.152: R20.1 56.05,43.87 D8.A
OVERRIDE  (via drill 0.35)
  Top 0.152: JP3.1 45.72,9.61 v46.23,10.12 | v33.53,26.38 31.5,28.41 31.5,30.95 v31.24,31.2 | v28.96,32.98 27.43,34.5 27.43,35.52 25.91,37.04 D6.A | D2.A 79.13,14.16 R18.1 76.45,16.89 76.45,18.76 75.18,20.03 64.01,20.03 61.98,17.99 61.98,16.22 61.72,15.96 53.59,15.96 52.45,14.82 X1.7
  Bottom 0.152: v31.24,31.2 29.46,32.98 v28.96,32.98 | X1.7 51.03,13.14 51.03,11.56 49.59,10.12 v46.23,10.12 45.44,10.91 44.37,10.91 43.71,11.56 43.71,12.18 42.45,13.45 41.83,13.45 41.17,14.1 41.17,17.46 33.53,25.11 v33.53,26.38
RESET  (via drill 0.35)
  Top 0.127: R3.2 26.92,43.9 28.45,42.38 v28.45,42.12
  Top 0.152: v28.45,42.12 28.96,41.62 29.68,41.62 30.05,41.99 30.05,44.28 31.07,45.3 U2.1
  Bottom 0.127: J1.5 13.72,37.55 15.22,37.55 15.26,37.59 23.15,37.59 27.69,42.12 v28.45,42.12
RXI
  Top 0.152: 30.75,42.36 30.75,43.15 30.89,43.29 | 30.75,42.36 30.89,42.23 33.07,42.23 33.41,41.88 33.41,39.82 32.54,38.95 U2.6 32.82,38.21 33.28,38.21 34.19,37.3 36.32,37.3 36.78,36.84 36.78,16.77 37.59,15.96 47.55,15.96 48.79,14.72 48.79,14.1 49.45,13.45 50.6,13.45 51.21,12.84 51.64,12.84 | 30.89,43.29 31.63,44.03 U2.2 31.34,43.29 30.89,43.29 | 27.62,41.87 28.18,41.31 29.81,41.31 30.75,42.26 30.75,42.36
SCK  (via drill 0.35)
  Top 0.127: v39.88,44.16 42.54,44.16 42.67,44.03
  Top 0.152: U1.P$4 47.51,44.25 47.12,44.64 46.89,44.64 46.28,44.03 42.67,44.03 U2.19
  Bottom 0.127: J1.3 20.32,44.16 v39.88,44.16
TXO
  Top 0.152: U2.3 32.21,42.63 35.56,42.63 37.08,41.11
VBATT  (via drill 0.35)
  Top 0.305: R1.1 72.39,8.43 72.39,9.87 71.7,10.56 Q1.3 | U6.3 61.14,40.02 60.2,39.08 C10.1 | C10.1 57.7,39.08 R25.2 55.2,36.58 54.61,36.58 52.77,34.74 U5.3 | v60.45,39.08 C10.1 | 81.28,37.55 82.67,36.17 C11.1
  Top 0.406: Q1.3 68.76,10.56 66.29,8.09 v66.29,7.27 | 5.19,37.44 U3.1 6.1,38.48 6.1,39.08 6.86,39.84 7.62,39.84 8.13,39.33 8.06,39.26 U3.3 8.09,38.38 C2.1 8.13,35.99 8.13,35.27 5.81,32.94 3.96,32.94 3.75,32.74 3.75,16.46 3.96,16.25 6.85,16.25
  Top 0.508: 5.19,37.44 5.06,37.31 S7.2 | 6.85,16.25 7.33,16.25 v8.89,14.69 | L1.P$1 81.28,37.55 77.72,34 v76.96,34
  Bottom 0.305: v76.96,34 72.96,38 61.23,38 61.17,38.06 60.45,38.06 v60.45,39.08
  Bottom 0.406: v76.96,34 76.96,14.6 69.63,7.27 v66.29,7.27 54.3,7.27 52.58,5.55 18.54,5.55
  Bottom 0.508: v8.89,14.69 10.52,13.07 10.52,11.49 13.33,8.67 15.04,8.67 18.16,5.55 18.54,5.55
VOUT  (via drill 0.35)
  Top 0.305: v61.98,8.34 61.98,8.09 64.77,5.29 75.69,5.29 76.16,5.77 76.16,8.38 Q1.5 Q1.6 74.66,10.57 75.32,10.57 75.75,11.01 75.75,11.93 75.44,12.24 75.44,18.25 74.42,19.26 72.39,19.26 71.26,18.13 D1.A
  Bottom 0.305: v61.98,8.34 61.47,7.83 61.21,7.83
  Bottom 0.406: JP3.2 43.89,7.83 45.18,9.13 53.93,9.13 55.23,7.83 61.21,7.83 61.72,7.83 | 61.98,10.12 v61.98,8.34

### Text on the board
tPlace: VOUT | VIN | GND | GND | WAKE
tNames: Comfort Maps / Samuel Clay / V6 2020-05-15